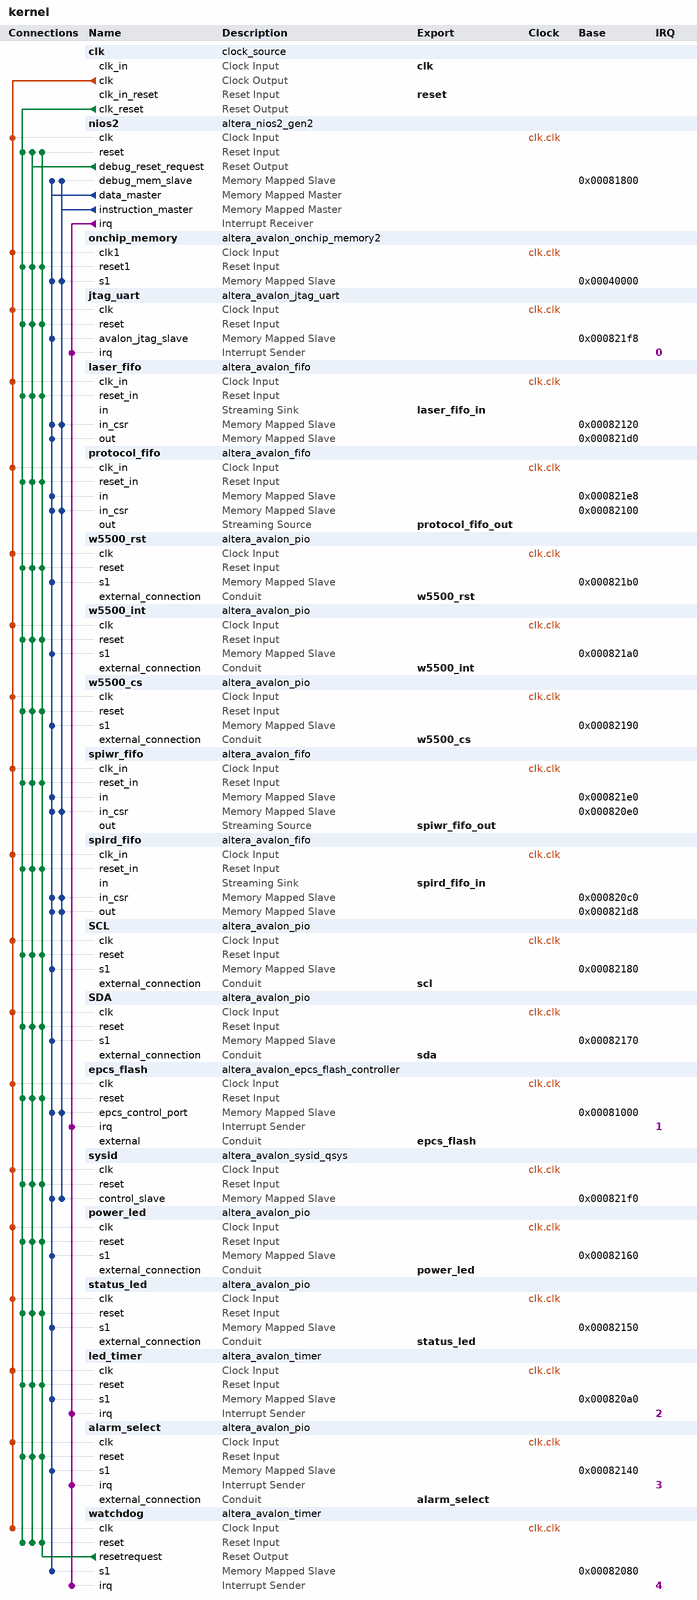
[diagram p0: system contents]
# Platform Designer (Qsys) system kernel, Cyclone IV GX EP4CGX50CF23I7
# Parameters at their usual value, and those the tool derives, are not listed.
package require -exact qsys 18.0
create_system kernel
set_project_property DEVICE_FAMILY {Cyclone IV GX}
set_project_property DEVICE EP4CGX50CF23I7

add_instance clk clock_source 18.0
set_instance_parameter_value clk clockFrequency 100000000

add_instance nios2 altera_nios2_gen2 18.0
set_instance_parameter_value nios2 dcache_size 0
set_instance_parameter_value nios2 exceptionSlave onchip_memory.s1
set_instance_parameter_value nios2 icache_size 4096
set_instance_parameter_value nios2 impl Fast
set_instance_parameter_value nios2 resetSlave epcs_flash.epcs_control_port
set_instance_parameter_value nios2 setting_activateTrace true

add_instance onchip_memory altera_avalon_onchip_memory2 18.0
set_instance_parameter_value onchip_memory dataWidth 32
set_instance_parameter_value onchip_memory dualPort false
set_instance_parameter_value onchip_memory initMemContent true
set_instance_parameter_value onchip_memory initializationFileName onchip_mem.hex
set_instance_parameter_value onchip_memory memorySize 184320

add_instance jtag_uart altera_avalon_jtag_uart 18.0
set_instance_parameter_value jtag_uart simInteractiveOptions NO_INTERACTIVE_WINDOWS

add_instance laser_fifo altera_avalon_fifo 18.0
set_instance_parameter_value laser_fifo bitsPerSymbol 16
set_instance_parameter_value laser_fifo channelWidth 0
set_instance_parameter_value laser_fifo errorWidth 0
set_instance_parameter_value laser_fifo fifoDepth 2048
set_instance_parameter_value laser_fifo fifoInputInterfaceOptions AVALONST_SINK
set_instance_parameter_value laser_fifo fifoOutputInterfaceOptions AVALONMM_READ
set_instance_parameter_value laser_fifo singleClockMode true
set_instance_parameter_value laser_fifo symbolsPerBeat 2
set_instance_parameter_value laser_fifo useIRQ false
set_instance_parameter_value laser_fifo usePacket false
set_instance_parameter_value laser_fifo useReadControl false

add_instance protocol_fifo altera_avalon_fifo 18.0
set_instance_parameter_value protocol_fifo bitsPerSymbol 16
set_instance_parameter_value protocol_fifo channelWidth 0
set_instance_parameter_value protocol_fifo errorWidth 0
set_instance_parameter_value protocol_fifo fifoDepth 1024
set_instance_parameter_value protocol_fifo fifoInputInterfaceOptions AVALONMM_WRITE
set_instance_parameter_value protocol_fifo fifoOutputInterfaceOptions AVALONST_SOURCE
set_instance_parameter_value protocol_fifo singleClockMode true
set_instance_parameter_value protocol_fifo symbolsPerBeat 2
set_instance_parameter_value protocol_fifo useIRQ false
set_instance_parameter_value protocol_fifo usePacket false
set_instance_parameter_value protocol_fifo useReadControl false

add_instance w5500_rst altera_avalon_pio 18.0
set_instance_parameter_value w5500_rst direction Output
set_instance_parameter_value w5500_rst width 1

add_instance w5500_int altera_avalon_pio 18.0
set_instance_parameter_value w5500_int direction InOut
set_instance_parameter_value w5500_int width 1

add_instance w5500_cs altera_avalon_pio 18.0
set_instance_parameter_value w5500_cs direction Output
set_instance_parameter_value w5500_cs width 1

add_instance spiwr_fifo altera_avalon_fifo 18.0
set_instance_parameter_value spiwr_fifo bitsPerSymbol 16
set_instance_parameter_value spiwr_fifo channelWidth 0
set_instance_parameter_value spiwr_fifo errorWidth 0
set_instance_parameter_value spiwr_fifo fifoDepth 16
set_instance_parameter_value spiwr_fifo fifoInputInterfaceOptions AVALONMM_WRITE
set_instance_parameter_value spiwr_fifo fifoOutputInterfaceOptions AVALONST_SOURCE
set_instance_parameter_value spiwr_fifo singleClockMode true
set_instance_parameter_value spiwr_fifo symbolsPerBeat 2
set_instance_parameter_value spiwr_fifo useIRQ false
set_instance_parameter_value spiwr_fifo usePacket false
set_instance_parameter_value spiwr_fifo useReadControl false

add_instance spird_fifo altera_avalon_fifo 18.0
set_instance_parameter_value spird_fifo bitsPerSymbol 16
set_instance_parameter_value spird_fifo channelWidth 0
set_instance_parameter_value spird_fifo errorWidth 0
set_instance_parameter_value spird_fifo fifoDepth 2048
set_instance_parameter_value spird_fifo fifoInputInterfaceOptions AVALONST_SINK
set_instance_parameter_value spird_fifo fifoOutputInterfaceOptions AVALONMM_READ
set_instance_parameter_value spird_fifo singleClockMode true
set_instance_parameter_value spird_fifo symbolsPerBeat 2
set_instance_parameter_value spird_fifo useIRQ false
set_instance_parameter_value spird_fifo usePacket false
set_instance_parameter_value spird_fifo useReadControl false

add_instance SCL altera_avalon_pio 18.0
set_instance_parameter_value SCL direction Output
set_instance_parameter_value SCL width 1

add_instance SDA altera_avalon_pio 18.0
set_instance_parameter_value SDA direction Bidir
set_instance_parameter_value SDA width 1

add_instance epcs_flash altera_avalon_epcs_flash_controller 18.0
set_instance_parameter_value epcs_flash resetrequest_enabled true

add_instance sysid altera_avalon_sysid_qsys 18.0
set_instance_parameter_value sysid id 74565

add_instance power_led altera_avalon_pio 18.0
set_instance_parameter_value power_led direction Output
set_instance_parameter_value power_led width 1

add_instance status_led altera_avalon_pio 18.0
set_instance_parameter_value status_led direction Output
set_instance_parameter_value status_led width 1

add_instance led_timer altera_avalon_timer 18.0
set_instance_parameter_value led_timer period 1
set_instance_parameter_value led_timer periodUnits MSEC

add_instance alarm_select altera_avalon_pio 18.0
set_instance_parameter_value alarm_select bitClearingEdgeCapReg true
set_instance_parameter_value alarm_select captureEdge true
set_instance_parameter_value alarm_select direction Input
set_instance_parameter_value alarm_select generateIRQ true
set_instance_parameter_value alarm_select irqType EDGE
set_instance_parameter_value alarm_select width 4

add_instance watchdog altera_avalon_timer 18.0
set_instance_parameter_value watchdog alwaysRun true
set_instance_parameter_value watchdog fixedPeriod true
set_instance_parameter_value watchdog period 5
set_instance_parameter_value watchdog periodUnits SEC
set_instance_parameter_value watchdog resetOutput true
set_instance_parameter_value watchdog snapshot false

# connections
add_connection clk.clk alarm_select.clk clock
add_connection clk.clk epcs_flash.clk clock
add_connection clk.clk jtag_uart.clk clock
add_connection clk.clk laser_fifo.clk_in clock
add_connection clk.clk led_timer.clk clock
add_connection clk.clk nios2.clk clock
add_connection clk.clk onchip_memory.clk1 clock
add_connection clk.clk power_led.clk clock
add_connection clk.clk protocol_fifo.clk_in clock
add_connection clk.clk SCL.clk clock
add_connection clk.clk SDA.clk clock
add_connection clk.clk spird_fifo.clk_in clock
add_connection clk.clk spiwr_fifo.clk_in clock
add_connection clk.clk status_led.clk clock
add_connection clk.clk sysid.clk clock
add_connection clk.clk w5500_cs.clk clock
add_connection clk.clk w5500_int.clk clock
add_connection clk.clk w5500_rst.clk clock
add_connection clk.clk watchdog.clk clock
add_connection clk.clk_reset alarm_select.reset reset
add_connection clk.clk_reset epcs_flash.reset reset
add_connection clk.clk_reset jtag_uart.reset reset
add_connection clk.clk_reset laser_fifo.reset_in reset
add_connection clk.clk_reset led_timer.reset reset
add_connection clk.clk_reset nios2.reset reset
add_connection clk.clk_reset onchip_memory.reset1 reset
add_connection clk.clk_reset power_led.reset reset
add_connection clk.clk_reset protocol_fifo.reset_in reset
add_connection clk.clk_reset SCL.reset reset
add_connection clk.clk_reset SDA.reset reset
add_connection clk.clk_reset spird_fifo.reset_in reset
add_connection clk.clk_reset spiwr_fifo.reset_in reset
add_connection clk.clk_reset status_led.reset reset
add_connection clk.clk_reset sysid.reset reset
add_connection clk.clk_reset w5500_cs.reset reset
add_connection clk.clk_reset w5500_int.reset reset
add_connection clk.clk_reset w5500_rst.reset reset
add_connection clk.clk_reset watchdog.reset reset
add_connection nios2.debug_reset_request alarm_select.reset reset
add_connection nios2.debug_reset_request epcs_flash.reset reset
add_connection nios2.debug_reset_request jtag_uart.reset reset
add_connection nios2.debug_reset_request laser_fifo.reset_in reset
add_connection nios2.debug_reset_request led_timer.reset reset
add_connection nios2.debug_reset_request nios2.reset reset
add_connection nios2.debug_reset_request onchip_memory.reset1 reset
add_connection nios2.debug_reset_request power_led.reset reset
add_connection nios2.debug_reset_request protocol_fifo.reset_in reset
add_connection nios2.debug_reset_request SCL.reset reset
add_connection nios2.debug_reset_request SDA.reset reset
add_connection nios2.debug_reset_request spird_fifo.reset_in reset
add_connection nios2.debug_reset_request spiwr_fifo.reset_in reset
add_connection nios2.debug_reset_request status_led.reset reset
add_connection nios2.debug_reset_request sysid.reset reset
add_connection nios2.debug_reset_request w5500_cs.reset reset
add_connection nios2.debug_reset_request w5500_int.reset reset
add_connection nios2.debug_reset_request w5500_rst.reset reset
add_connection nios2.debug_reset_request watchdog.reset reset
add_connection watchdog.resetrequest alarm_select.reset reset
add_connection watchdog.resetrequest epcs_flash.reset reset
add_connection watchdog.resetrequest jtag_uart.reset reset
add_connection watchdog.resetrequest laser_fifo.reset_in reset
add_connection watchdog.resetrequest led_timer.reset reset
add_connection watchdog.resetrequest nios2.reset reset
add_connection watchdog.resetrequest onchip_memory.reset1 reset
add_connection watchdog.resetrequest power_led.reset reset
add_connection watchdog.resetrequest protocol_fifo.reset_in reset
add_connection watchdog.resetrequest SCL.reset reset
add_connection watchdog.resetrequest SDA.reset reset
add_connection watchdog.resetrequest spird_fifo.reset_in reset
add_connection watchdog.resetrequest spiwr_fifo.reset_in reset
add_connection watchdog.resetrequest status_led.reset reset
add_connection watchdog.resetrequest sysid.reset reset
add_connection watchdog.resetrequest w5500_cs.reset reset
add_connection watchdog.resetrequest w5500_int.reset reset
add_connection watchdog.resetrequest w5500_rst.reset reset
add_connection watchdog.resetrequest watchdog.reset reset
add_connection nios2.data_master alarm_select.s1 avalon
set_connection_parameter_value nios2.data_master/alarm_select.s1 baseAddress 0x00082140
add_connection nios2.data_master epcs_flash.epcs_control_port avalon
set_connection_parameter_value nios2.data_master/epcs_flash.epcs_control_port baseAddress 0x00081000
add_connection nios2.data_master jtag_uart.avalon_jtag_slave avalon
set_connection_parameter_value nios2.data_master/jtag_uart.avalon_jtag_slave baseAddress 0x000821f8
add_connection nios2.data_master laser_fifo.in_csr avalon
set_connection_parameter_value nios2.data_master/laser_fifo.in_csr baseAddress 0x00082120
add_connection nios2.data_master laser_fifo.out avalon
set_connection_parameter_value nios2.data_master/laser_fifo.out baseAddress 0x000821d0
add_connection nios2.data_master led_timer.s1 avalon
set_connection_parameter_value nios2.data_master/led_timer.s1 baseAddress 0x000820a0
add_connection nios2.data_master nios2.debug_mem_slave avalon
set_connection_parameter_value nios2.data_master/nios2.debug_mem_slave baseAddress 0x00081800
add_connection nios2.data_master onchip_memory.s1 avalon
set_connection_parameter_value nios2.data_master/onchip_memory.s1 baseAddress 0x00040000
add_connection nios2.data_master power_led.s1 avalon
set_connection_parameter_value nios2.data_master/power_led.s1 baseAddress 0x00082160
add_connection nios2.data_master protocol_fifo.in avalon
set_connection_parameter_value nios2.data_master/protocol_fifo.in baseAddress 0x000821e8
add_connection nios2.data_master protocol_fifo.in_csr avalon
set_connection_parameter_value nios2.data_master/protocol_fifo.in_csr baseAddress 0x00082100
add_connection nios2.data_master SCL.s1 avalon
set_connection_parameter_value nios2.data_master/SCL.s1 baseAddress 0x00082180
add_connection nios2.data_master SDA.s1 avalon
set_connection_parameter_value nios2.data_master/SDA.s1 baseAddress 0x00082170
add_connection nios2.data_master spird_fifo.in_csr avalon
set_connection_parameter_value nios2.data_master/spird_fifo.in_csr baseAddress 0x000820c0
add_connection nios2.data_master spird_fifo.out avalon
set_connection_parameter_value nios2.data_master/spird_fifo.out baseAddress 0x000821d8
add_connection nios2.data_master spiwr_fifo.in avalon
set_connection_parameter_value nios2.data_master/spiwr_fifo.in baseAddress 0x000821e0
add_connection nios2.data_master spiwr_fifo.in_csr avalon
set_connection_parameter_value nios2.data_master/spiwr_fifo.in_csr baseAddress 0x000820e0
add_connection nios2.data_master status_led.s1 avalon
set_connection_parameter_value nios2.data_master/status_led.s1 baseAddress 0x00082150
add_connection nios2.data_master sysid.control_slave avalon
set_connection_parameter_value nios2.data_master/sysid.control_slave baseAddress 0x000821f0
add_connection nios2.data_master w5500_cs.s1 avalon
set_connection_parameter_value nios2.data_master/w5500_cs.s1 baseAddress 0x00082190
add_connection nios2.data_master w5500_int.s1 avalon
set_connection_parameter_value nios2.data_master/w5500_int.s1 baseAddress 0x000821a0
add_connection nios2.data_master w5500_rst.s1 avalon
set_connection_parameter_value nios2.data_master/w5500_rst.s1 baseAddress 0x000821b0
add_connection nios2.data_master watchdog.s1 avalon
set_connection_parameter_value nios2.data_master/watchdog.s1 baseAddress 0x00082080
add_connection nios2.instruction_master epcs_flash.epcs_control_port avalon
set_connection_parameter_value nios2.instruction_master/epcs_flash.epcs_control_port baseAddress 0x00081000
add_connection nios2.instruction_master laser_fifo.in_csr avalon
set_connection_parameter_value nios2.instruction_master/laser_fifo.in_csr baseAddress 0x00082120
add_connection nios2.instruction_master nios2.debug_mem_slave avalon
set_connection_parameter_value nios2.instruction_master/nios2.debug_mem_slave baseAddress 0x00081800
add_connection nios2.instruction_master onchip_memory.s1 avalon
set_connection_parameter_value nios2.instruction_master/onchip_memory.s1 baseAddress 0x00040000
add_connection nios2.instruction_master protocol_fifo.in_csr avalon
set_connection_parameter_value nios2.instruction_master/protocol_fifo.in_csr baseAddress 0x00082100
add_connection nios2.instruction_master spird_fifo.in_csr avalon
set_connection_parameter_value nios2.instruction_master/spird_fifo.in_csr baseAddress 0x000820c0
add_connection nios2.instruction_master spird_fifo.out avalon
set_connection_parameter_value nios2.instruction_master/spird_fifo.out baseAddress 0x000821d8
add_connection nios2.instruction_master spiwr_fifo.in_csr avalon
set_connection_parameter_value nios2.instruction_master/spiwr_fifo.in_csr baseAddress 0x000820e0
add_connection nios2.instruction_master sysid.control_slave avalon
set_connection_parameter_value nios2.instruction_master/sysid.control_slave baseAddress 0x000821f0
add_connection nios2.irq alarm_select.irq interrupt
set_connection_parameter_value nios2.irq/alarm_select.irq irqNumber 3
add_connection nios2.irq epcs_flash.irq interrupt
set_connection_parameter_value nios2.irq/epcs_flash.irq irqNumber 1
add_connection nios2.irq jtag_uart.irq interrupt
set_connection_parameter_value nios2.irq/jtag_uart.irq irqNumber 0
add_connection nios2.irq led_timer.irq interrupt
set_connection_parameter_value nios2.irq/led_timer.irq irqNumber 2
add_connection nios2.irq watchdog.irq interrupt
set_connection_parameter_value nios2.irq/watchdog.irq irqNumber 4

# exported interfaces
add_interface alarm_select conduit end
set_interface_property alarm_select EXPORT_OF alarm_select.external_connection
add_interface clk clock sink
set_interface_property clk EXPORT_OF clk.clk_in
add_interface epcs_flash conduit end
set_interface_property epcs_flash EXPORT_OF epcs_flash.external
add_interface laser_fifo_in avalon_streaming sink
set_interface_property laser_fifo_in EXPORT_OF laser_fifo.in
add_interface power_led conduit end
set_interface_property power_led EXPORT_OF power_led.external_connection
add_interface protocol_fifo_out avalon_streaming source
set_interface_property protocol_fifo_out EXPORT_OF protocol_fifo.out
add_interface reset reset sink
set_interface_property reset EXPORT_OF clk.clk_in_reset
add_interface scl conduit end
set_interface_property scl EXPORT_OF SCL.external_connection
add_interface sda conduit end
set_interface_property sda EXPORT_OF SDA.external_connection
add_interface spird_fifo_in avalon_streaming sink
set_interface_property spird_fifo_in EXPORT_OF spird_fifo.in
add_interface spiwr_fifo_out avalon_streaming source
set_interface_property spiwr_fifo_out EXPORT_OF spiwr_fifo.out
add_interface status_led conduit end
set_interface_property status_led EXPORT_OF status_led.external_connection
add_interface w5500_cs conduit end
set_interface_property w5500_cs EXPORT_OF w5500_cs.external_connection
add_interface w5500_int conduit end
set_interface_property w5500_int EXPORT_OF w5500_int.external_connection
add_interface w5500_rst conduit end
set_interface_property w5500_rst EXPORT_OF w5500_rst.external_connection

set_interconnect_requirement {$system} qsys_mm.clockCrossingAdapter HANDSHAKE
set_interconnect_requirement {$system} qsys_mm.maxAdditionalLatency 1

save_system kernel.qsys
